# Altium schematic sheet VUE_PIC32_v1_0_Design_Notes.SchDoc: [VUE PIC32]
size A4; Engineer: JFDuval; Revision: 0.1
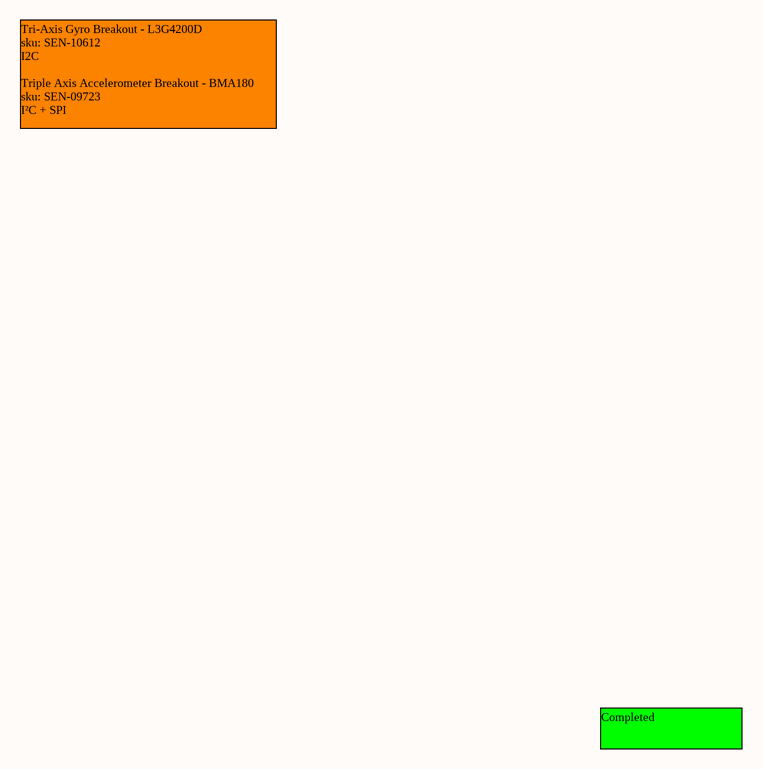
[diagram p0: VUE_PIC32_v1_0_Design_Notes.SchDoc]

## Notes on the sheet
- Tri-Axis Gyro Breakout - L3G4200D
  sku: SEN-10612
  I2C
  Triple Axis Accelerometer Breakout - BMA180
  sku: SEN-09723
  I²C + SPI
- Completed